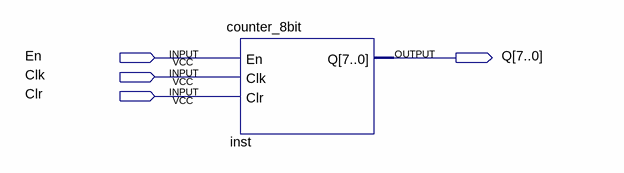
[diagram p0: schematic sheet]
// Quartus schematic counter_8bit.bdf as structural Verilog: 1 symbols, 4 pins
module counter_8bit (
  input  En,
  input  Clk,
  input  Clr,
  output [7:0] Q
);

  counter_8bit inst (.En(En), .Clk(Clk), .Clr(Clr), .Q(Q));
endmodule
